# Altium schematic sheet GR_Interface_Emilie.SchDoc
size A4
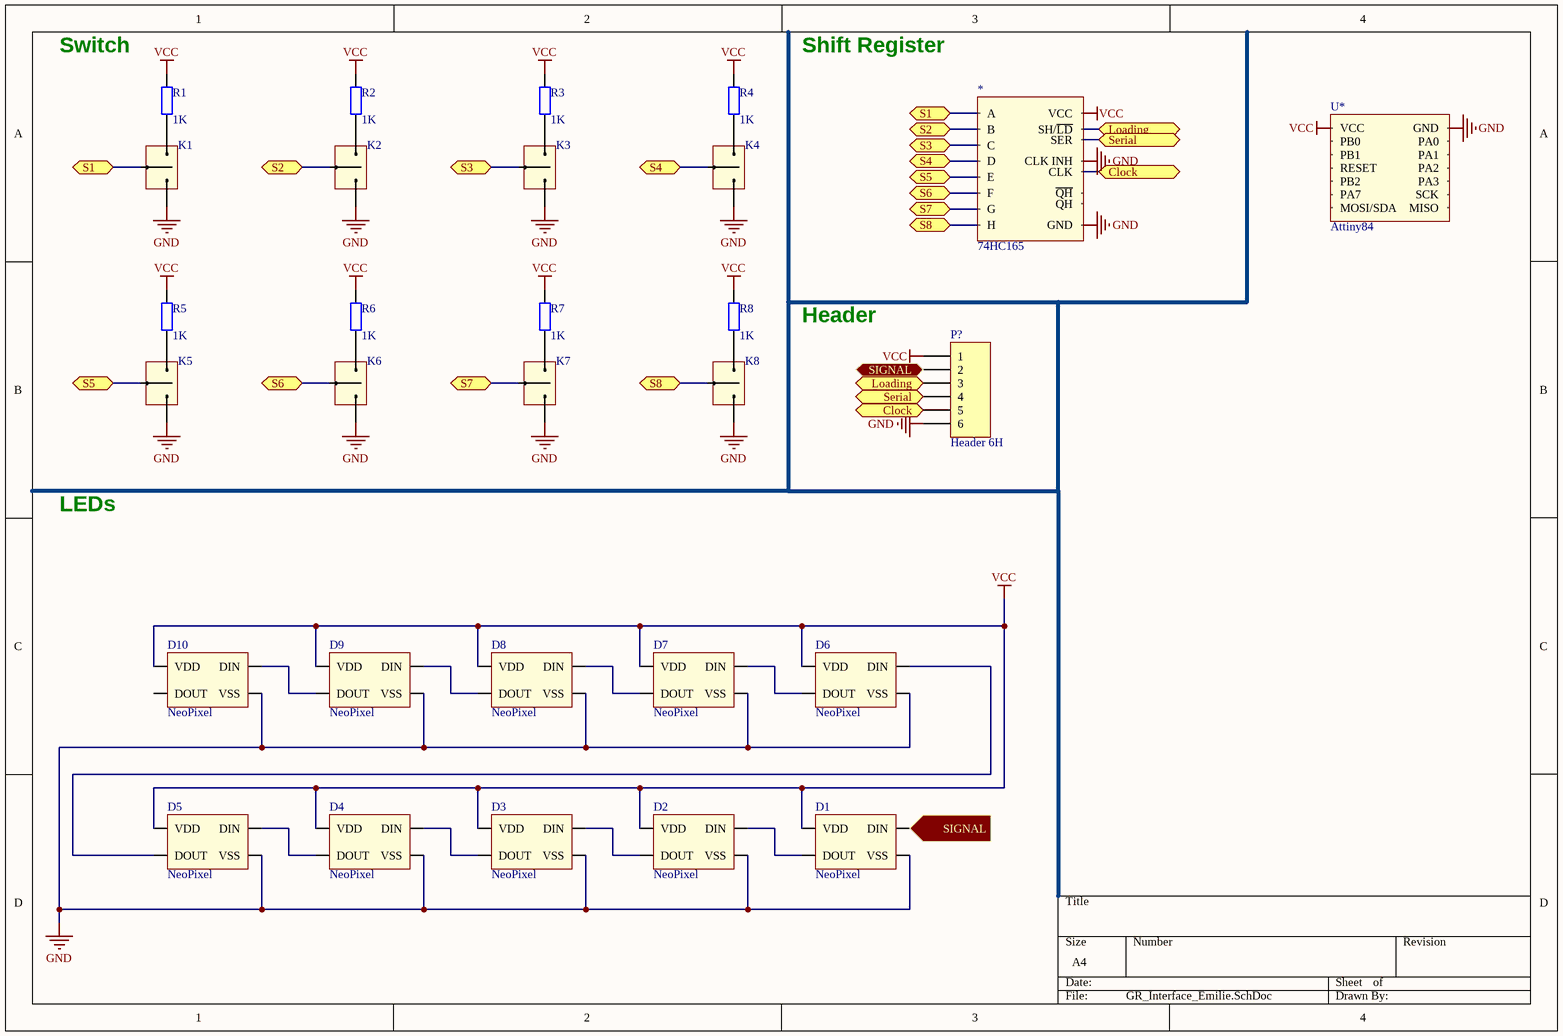
[diagram p0: GR_Interface_Emilie.SchDoc]

## Parts
*  74HC165  [16 pins SOIC, TI]
D1  NeoPixel  [Neopixel]
D2  NeoPixel  [Neopixel]
D3  NeoPixel  [Neopixel]
D4  NeoPixel  [Neopixel]
D5  NeoPixel  [Neopixel]
D6  NeoPixel  [Neopixel]
D7  NeoPixel  [Neopixel]
D8  NeoPixel  [Neopixel]
D9  NeoPixel  [Neopixel]
D10  NeoPixel  [Neopixel]
K1  Switch  [SWITCH]  (value not drawn)
K2  Switch  [SWITCH]  (value not drawn)
K3  Switch  [SWITCH]  (value not drawn)
K4  Switch  [SWITCH]  (value not drawn)
K5  Switch  [SWITCH]  (value not drawn)
K6  Switch  [SWITCH]  (value not drawn)
K7  Switch  [SWITCH]  (value not drawn)
K8  Switch  [SWITCH]  (value not drawn)
P?  Header 6H  [MOLEX SPOX 6X1H]
R1  value 1K  [3.2X1.6X1.1]  (hidden comment: Res2)
R2  value 1K  [3.2X1.6X1.1]
R3  value 1K  [3.2X1.6X1.1]  (hidden comment: Res2)
R4  value 1K  [3.2X1.6X1.1]  (hidden comment: Res2)
R5  value 1K  [3.2X1.6X1.1]  (hidden comment: Res2)
R6  value 1K  [3.2X1.6X1.1]  (hidden comment: Res2)
R7  value 1K  [3.2X1.6X1.1]  (hidden comment: Res2)
R8  value 1K  [3.2X1.6X1.1]  (hidden comment: Res2)
U*  Attiny84  [Attiny84 SOIC]

## Ports
Clock, Loading, S1, S2, S3, S4, S5, S6, S7, S8, Serial, SIGNAL

## Nets
GND: *.8(GND) *.15(CLK_INH) D1.2(VSS) D2.2(VSS) D3.2(VSS) D4.2(VSS) D5.2(VSS) D6.2(VSS) D7.2(VSS) D8.2(VSS) D9.2(VSS) D10.2(VSS) K1.0(L) K2.0(L) K3.0(L) K4.0(L) K5.0(L) K6.0(L) K7.0(L) K8.0(L) P?.6 U*.14(GND)
VCC: *.16(VCC) D1.4(VDD) D2.4(VDD) D3.4(VDD) D4.4(VDD) D5.4(VDD) D6.4(VDD) D7.4(VDD) D8.4(VDD) D9.4(VDD) D10.4(VDD) P?.1 R1.2 R2.2 R3.2 R4.2 R5.2 R6.2 R7.2 R8.2 U*.1(VCC)
Clock: *.2(CLK) P?.5 ; port Clock
Loading: *.1(SH/~{LD}) P?.3 ; port Loading
S1: *.11(A) K1.1(M) ; port S1
S2: *.12(B) K2.1(M) ; port S2
S3: *.13(C) K3.1(M) ; port S3
S4: *.14(D) K4.1(M) ; port S4
S5: *.3(E) K5.1(M) ; port S5
S6: *.4(F) K6.1(M) ; port S6
S7: *.5(G) K7.1(M) ; port S7
S8: *.6(H) K8.1(M) ; port S8
Serial: *.10(SER) P?.4 ; port Serial
SIGNAL: D1.3(DIN) P?.2 ; port SIGNAL
NetD1_1: D1.1(DOUT) D2.3(DIN)
NetD2_1: D2.1(DOUT) D3.3(DIN)
NetD3_1: D3.1(DOUT) D4.3(DIN)
NetD4_1: D4.1(DOUT) D5.3(DIN)
NetD5_1: D5.1(DOUT) D6.3(DIN)
NetD6_1: D6.1(DOUT) D7.3(DIN)
NetD7_1: D7.1(DOUT) D8.3(DIN)
NetD8_1: D8.1(DOUT) D9.3(DIN)
NetD9_1: D9.1(DOUT) D10.3(DIN)
NetK1_2: K1.2(R) R1.1
NetK2_2: K2.2(R) R2.1
NetK3_2: K3.2(R) R3.1
NetK4_2: K4.2(R) R4.1
NetK5_2: K5.2(R) R5.1
NetK6_2: K6.2(R) R6.1
NetK7_2: K7.2(R) R7.1
NetK8_2: K8.2(R) R8.1

Not connected (* = marked no-connect by the designer): * 7(~{QH}) 9(QH); D10 1(DOUT); U* 2(PB0) 3(PB1) 4(RESET) 5(PB2) 6(PA7) 7(MOSI/SDA) 8(MISO) 9(SCK) 10(PA3) 11(PA2) 12(PA1) 13(PA0)

## Notes on the sheet
- Switch
- Shift Register
- Header
- LEDs

## Library data of the parts
* = SN74HC165: 8 bits Shift Register
K1-K8 = Switch: 3 pos switch, 09.03290.01
P? = Header 6H: Header, 6-Pin, Right Angle; LatestRevisionDate: 17-Jul-2002; LatestRevisionNote: Re-released for DXP Platform.; Publisher: Altium Limited
R1-R8 = Res2: Resistor; Published: 8-Jun-2000; LatestRevisionDate: 17-Jul-2002; LatestRevisionNote: Re-released for DXP Platform.; PackageReference: AXIAL-0.4; Publisher: Altium Limited; PackageDescription: Axial Device, Thru-Hole; 2 Leads; 0.4 in Pin Spacing